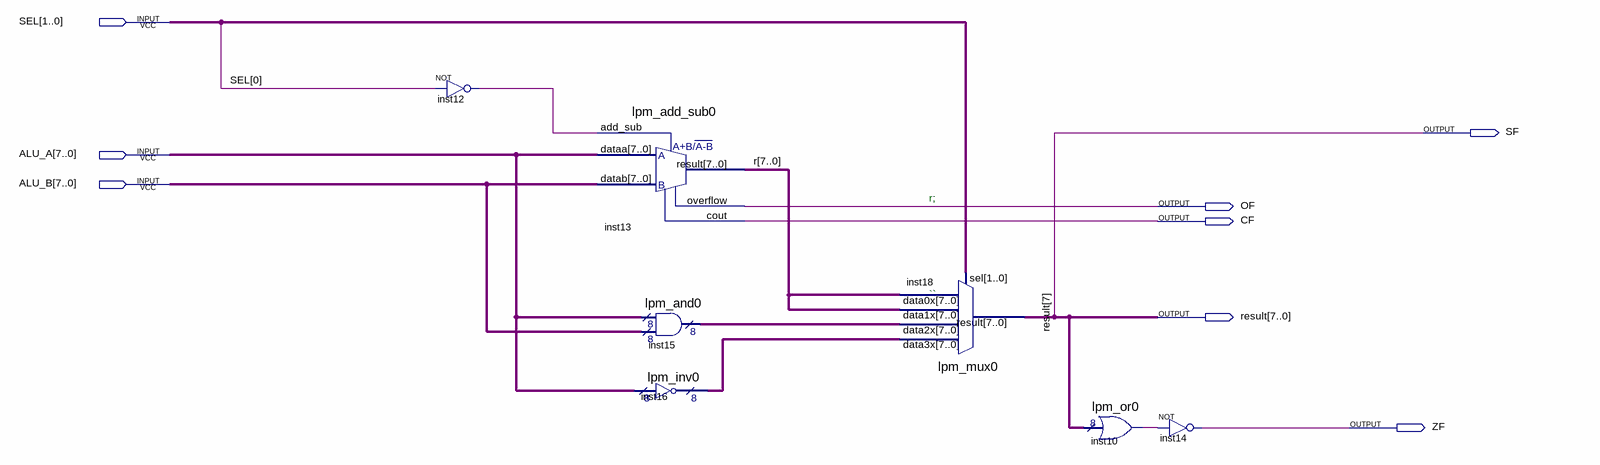
[diagram p0: schematic sheet]
// Quartus schematic COS_lab2.1.bdf as structural Verilog: 7 symbols, 8 pins
module \COS_lab2.1  (
  input  [1:0] SEL,
  input  [7:0] ALU_A,
  input  [7:0] ALU_B,
  output SF,
  output OF,
  output CF,
  output [7:0] result,
  output ZF
);

  wire inst10_result, inst12_out;
  wire [7:0] inst15_result, inst16_result, r;

  not inst12 (inst12_out, SEL[0]);
  lpm_add_sub0 inst13 (.dataa(ALU_A), .datab(ALU_B), .add_sub(inst12_out), .result(r), .overflow(OF), .cout(CF));
  lpm_and0 inst15 (.data0x(ALU_A), .data1x(ALU_B), .result(inst15_result));
  lpm_inv0 inst16 (.data(ALU_A), .result(inst16_result));
  lpm_mux0 inst18 (.data3x(inst16_result), .data2x(inst15_result), .data1x(r), .data0x(r), .sel(SEL), .result(result));
  lpm_or0 inst10 (.data(result), .result(inst10_result));
  not inst14 (ZF, inst10_result);

  assign SF = result[7];

  // Notes on the sheet:
  //   r;
  //   ``
endmodule
